# EAGLE design OE5DXL-9600 (EAGLE 7.7.0)
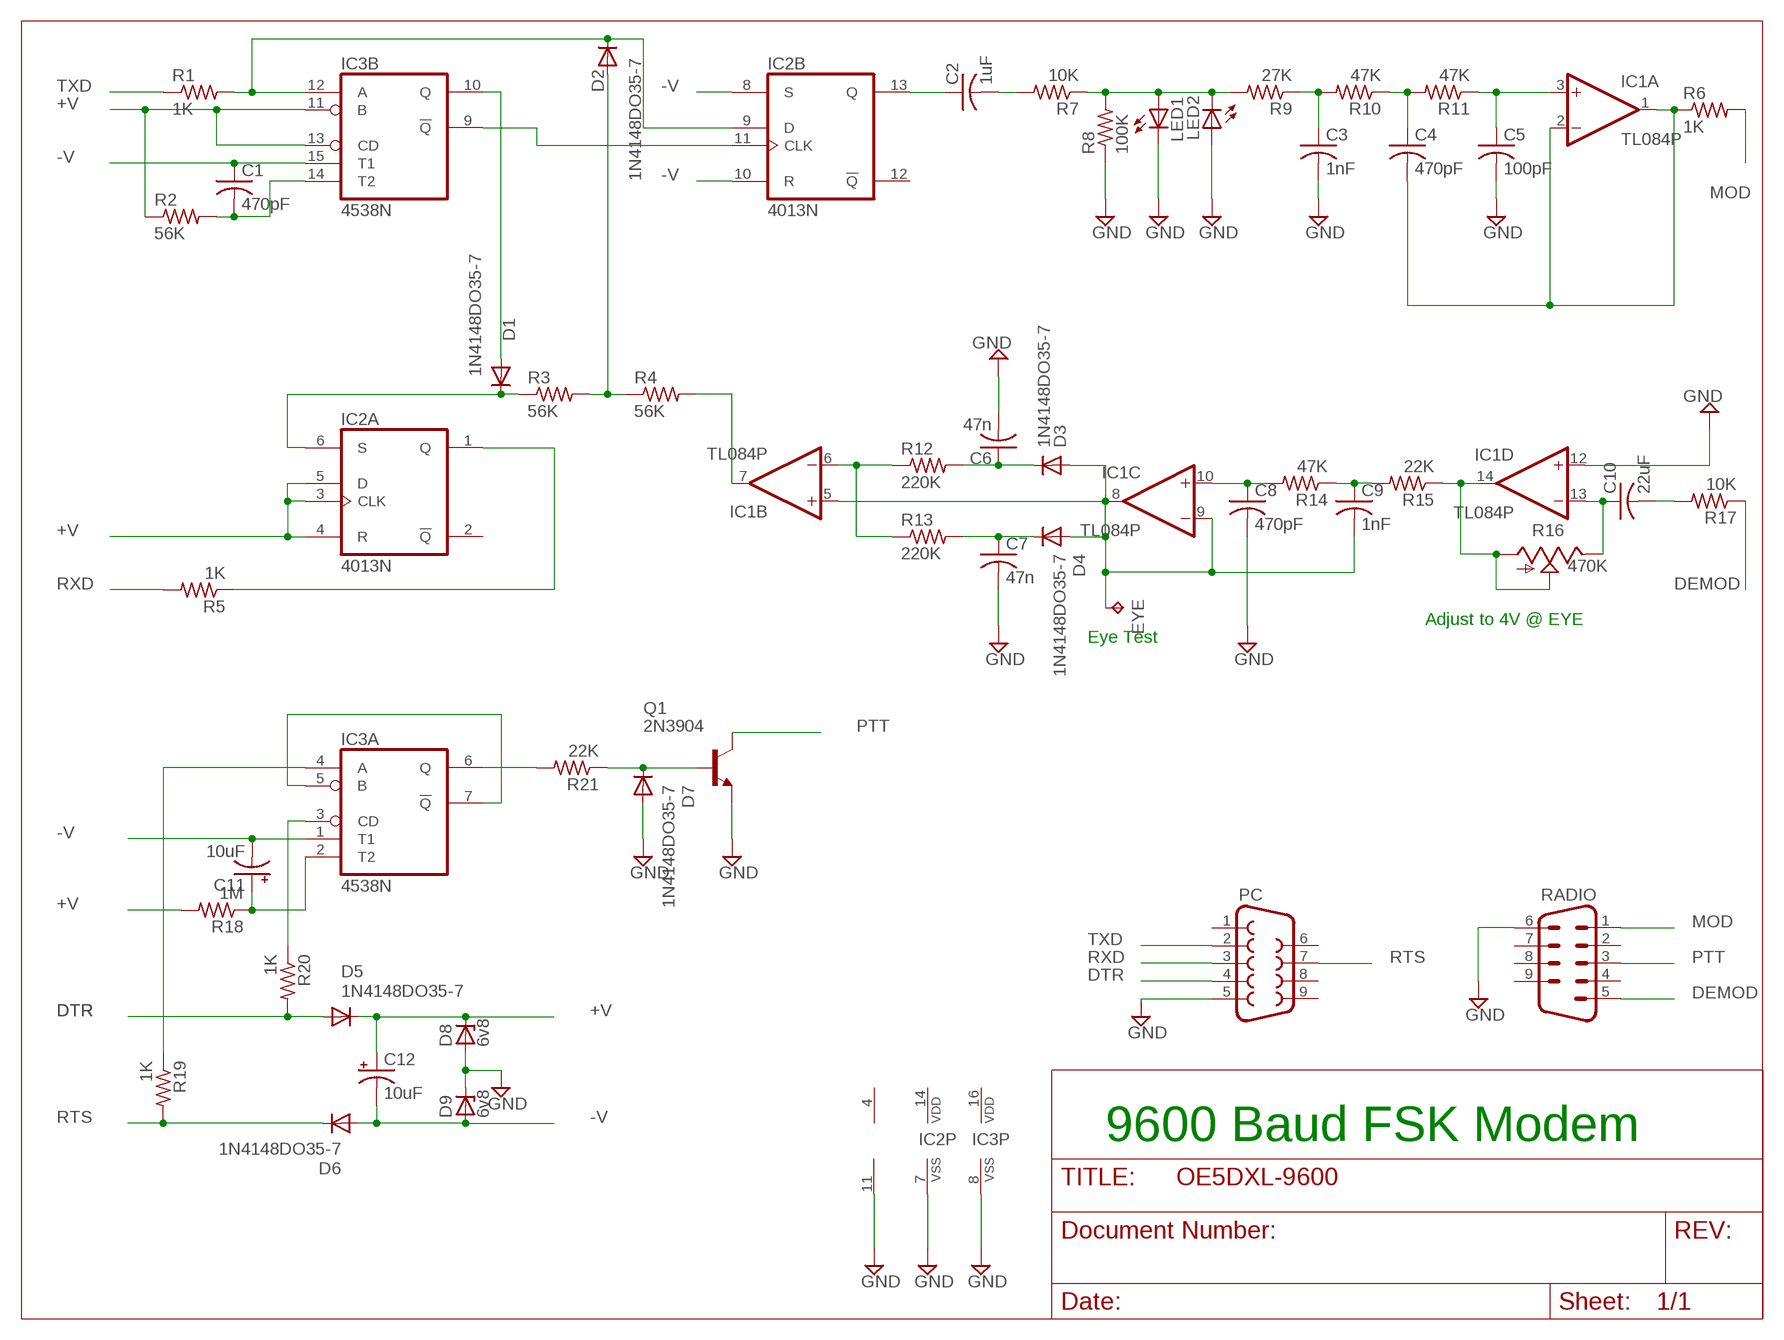
[diagram p0: schematic, sheet 1]

## Parts
C1  470pF  C-US025-025X050  [C025-025X050]
C2  1uF  C-US025-025X050  [C025-025X050]
C3  1nF  C-US025-025X050  [C025-025X050]
C4  470pF  C-US025-025X050  [C025-025X050]
C5  100pF  C-US025-025X050  [C025-025X050]
C6  47n  C-US025-025X050  [C025-025X050]
C7  47n  C-US025-025X050  [C025-025X050]
C8  470pF  C-US025-025X050  [C025-025X050]
C9  1nF  C-US025-025X050  [C025-025X050]
C10  22uF  C-US025-025X050  [C025-025X050]
C11  10uF  CPOL-USE2,5-6E  [E2,5-6E]
C12  10uF  CPOL-USE2,5-6E  [E2,5-6E]
D1  1N4148DO35-7  [DO35-7]
D2  1N4148DO35-7  [DO35-7]
D3  1N4148DO35-7  [DO35-7]
D4  1N4148DO35-7  [DO35-7]
D5  1N4148DO35-7  [DO35-7]
D6  1N4148DO35-7  [DO35-7]
D7  1N4148DO35-7  [DO35-7]
D8  6v8  ZENER-DIODEDO34-7  [DO34Z7]
D9  6v8  ZENER-DIODEDO34-7  [DO34Z7]
EYE  TPPAD1-13  [P1-13]
IC1  TL084P  [DIL14]
IC2  4013N  [DIL14]
IC3  4538N  [DIL16]
LED1  LED3MM  [LED3MM]
LED2  LED3MM  [LED3MM]
PC  F09D  [F09D]
Q1  2N3904  [TO92]
R1  1K  R-US_0207/2V  [0207/2V]
R2  56K  R-US_0207/2V  [0207/2V]
R3  56K  R-US_0207/2V  [0207/2V]
R4  56K  R-US_0207/2V  [0207/2V]
R5  1K  R-US_0207/2V  [0207/2V]
R6  1K  R-US_0207/2V  [0207/2V]
R7  10K  R-US_0207/2V  [0207/2V]
R8  100K  R-US_0207/2V  [0207/2V]
R9  27K  R-US_0207/2V  [0207/2V]
R10  47K  R-US_0207/2V  [0207/2V]
R11  47K  R-US_0207/2V  [0207/2V]
R12  220K  R-US_0207/2V  [0207/2V]
R13  220K  R-US_0207/2V  [0207/2V]
R14  47K  R-US_0207/2V  [0207/2V]
R15  22K  R-US_0207/2V  [0207/2V]
R16  470K  TRIM_US-CA6V  [CA6V]
R17  10K  R-US_0207/2V  [0207/2V]
R18  1M  R-US_0207/2V  [0207/2V]
R19  1K  R-US_0207/2V  [0207/2V]
R20  1K  R-US_0207/2V  [0207/2V]
R21  22K  R-US_0207/2V  [0207/2V]
RADIO  M09D  [M09D]

## Nets
+V: C12.+ D5.C D8.C IC2.3(A:CLK) IC2.4(A:R) IC2.5(A:D) IC3.11(B:B) IC3.13(B:CD) R2.1 R18.2
-V: C1.1 C11.- C12.- D6.A D9.A IC2.8(B:S) IC2.10(B:R) IC3.1(A:T1) IC3.15(B:T1)
DEMOD: R17.1 RADIO.5
DTR: D5.A PC.4 R20.2
GND: C3.2 C5.2 C6.2 C7.2 C8.2 D7.A D8.A D9.C IC1.11(P:V-) IC1.12(D:+IN) IC2.7(P:VSS) IC3.8(P:VSS) LED1.K(C) LED2.A PC.5 Q1.3(E) R8.1 RADIO.6
MOD: R6.2 RADIO.1
N$1: D2.C IC2.9(B:D) IC3.12(B:A) R1.2
N$2: D1.C IC2.6(A:S) R3.1
N$3: IC2.11(B:CLK) IC3.9(B:!Q)
N$4: D1.A IC3.10(B:Q)
N$5: C1.2 IC3.14(B:T2) R2.2
N$6: D2.A R3.2 R4.1
N$7: IC2.1(A:Q) R5.1
N$8: IC1.7(B:OUT) R4.2
N$9: C2.1 IC2.13(B:Q)
N$10: C2.2 R7.2
N$11: LED1.A LED2.K(C) R7.1 R8.2 R9.2
N$12: C3.1 R9.1 R10.2
N$13: C4.1 R10.1 R11.2
N$14: C5.1 IC1.3(A:+IN) R11.1
N$15: C4.2 IC1.1(A:OUT) IC1.2(A:-IN) R6.1
N$16: IC1.6(B:-IN) R12.1 R13.1
N$17: C6.1 D3.C R12.2
N$18: C9.2 D3.A D4.A EYE.TP IC1.5(B:+IN) IC1.8(C:OUT) IC1.9(C:-IN)
N$19: IC3.5(A:B) IC3.7(A:!Q)
N$20: C7.1 D4.C R13.2
N$21: C8.1 IC1.10(C:+IN) R14.2
N$22: C9.1 R14.1 R15.2
N$23: IC1.14(D:OUT) R15.1 R16.A R16.S
N$24: IC3.4(A:A) R19.1
N$25: C10.1 IC1.13(D:-IN) R16.E
N$26: C11.+ IC3.2(A:T2) R18.1
N$27: C10.2 R17.2
N$28: IC3.3(A:CD) R20.1
N$31: IC3.6(A:Q) R21.2
N$32: D7.C Q1.2(B) R21.1
PTT: Q1.1(C) RADIO.3
RTS: D6.C PC.7 R19.2
RXD: PC.3 R5.2
TXD: PC.2 R1.1
Unconnected: IC2.2(A:!Q) IC2.12(B:!Q) PC.1 PC.6 PC.8 PC.9 RADIO.2 RADIO.4 RADIO.7 RADIO.8 RADIO.9

## Notes on the sheet
- Adjust to 4V @ EYE
- Eye Test
- 9600 Baud FSK Modem

## Power pins joined to a net without a drawn wire
V+: IC1.4(P:V+)
VDD: IC2.14(P:VDD) IC3.16(P:VDD)

## Library data of the parts
C1-C10 = rcl:C-US: CAPACITOR, American symbol
C11 C12 = rcl:CPOL-US: POLARIZED CAPACITOR, American symbol
D1-D7 = diode:1N4148: DIODE high speed (Philips)
D8 D9 = diode:ZENER-DIODE: Z-Diode
EYE = testpad:TP: Test pad
IC1 = linear:TL084: OP AMP
IC2 = 40xx:4013: Dual D FLIP FLOP, set/reset
IC3 = 45xx:4538: Dual precision monostable MULTIVIBRATOR
LED1 LED2 = led:LED: LED OSRAM: - CHIPLED LG R971, LG N971, LY N971, LG Q971, LY Q971, LO R971, LY R971 LH N974, LH R974 LS Q976, LO Q976, LY Q976 LO Q996 - Hyper CHIPLED LW Q18S LB Q993, LB Q99A, LB R99A - SideLED LS A670, LO A670, LY A670, LG A670, LP A670 LB A673, LV A673, LT A673, LW A673 LH A674 LY A675 LS A676, LA A676, LO A676, LY A676, LW A676 LS A679, LY A679, LG A679 - Hyper Micro SIDELED® LS Y876, LA Y876, LO Y876, LY Y876 LT Y87S - SmartLED LW L88C, LW L88S LB L89C, LB L89S, LG L890 LS L89K, LO L89K, LY L89K LS L896, LA L896, LO L896, LY L896 - TOPLED LS T670, LO T670, LY T670, LG T670, LP T670 LSG T670, LSP T670, LSY T670, LOP T670, LYG T670 LG T671, LOG T671, LSG T671 LB T673, LV T673, LT T673, LW T673 LH T674 LS T676, LA T676, LO T676, LY T676, LB T676, LH T676, LSB T676, LW T676 LB T67C, LV T67C, LT T67C, LS T67K, LO T67K, LY T67K, LW E67C LS E67B, LA E67B, LO E67B, LY E67B, LB E67C, LV E67C, LT E67C LW T67C LS T679, LY T679, LG T679 LS T770, LO T770, LY T770, LG T770, LP T770 LB T773, LV T773, LT T773, LW T773 LH T774 LS E675, LA E675, LY E675, LS T675 LS T776, LA T776, LO T776, LY T776, LB T776 LHGB T686 LT T68C, LB T68C - Hyper Mini TOPLED® LB M676 - Mini TOPLED Santana® LG M470 LS M47K, LO M47K, LY M47K Source: http://www.osram.convergy.de LUXEON: - LUMILED® LXK2-PW12-R00, LXK2-PW12-S00, LXK2-PW14-U00, LXK2-PW14-V00 LXK2-PM12-R00, LXK2-PM12-S00, LXK2-PM14-U00 LXK2-PE12-Q00, LXK2-PE12-R00, LXK2-PE12-S00, LXK2-PE14-T00, LXK2-PE14-U00 LXK2-PB12-K00, LXK2-PB12-L00, LXK2-PB12-M00, LXK2-PB14-N00, LXK2-PB14-P00, LXK2-PB14-Q00 LXK2-PR12-L00, LXK2-PR12-M00, LXK2-PR14-Q00, LXK2-PR14-R00 LXK2-PD12-Q00, LXK2-PD12-R00, LXK2-PD12-S00 LXK2-PH12-R00, LXK2-PH12-S00 LXK2-PL12-P00, LXK2-PL12-Q00, LXK2-PL12-R00 Source: www.luxeon.com KINGBRIGHT: KA-3528ASYC Source: www.kingbright.com
PC = con-subd:F09: SUB-D; OC_FARNELL: unknown; OC_NEWARK: unknown
Q1 = transistor-npn:2N3904: NPN Transistor
R1-R15 R17-R21 = rcl:R-US_: RESISTOR, American symbol
R16 = pot:TRIM_US-: POTENTIOMETER
RADIO = con-subd:M09: SUB-D; OC_FARNELL: unknown; OC_NEWARK: unknown

## Board
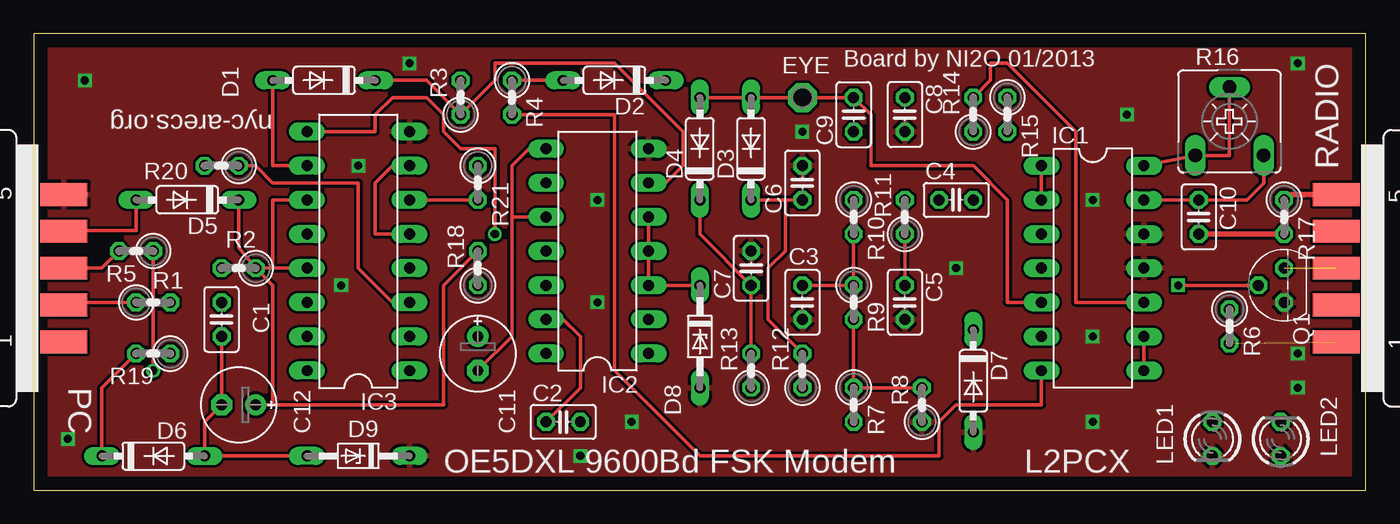
[diagram p1: board, top side]
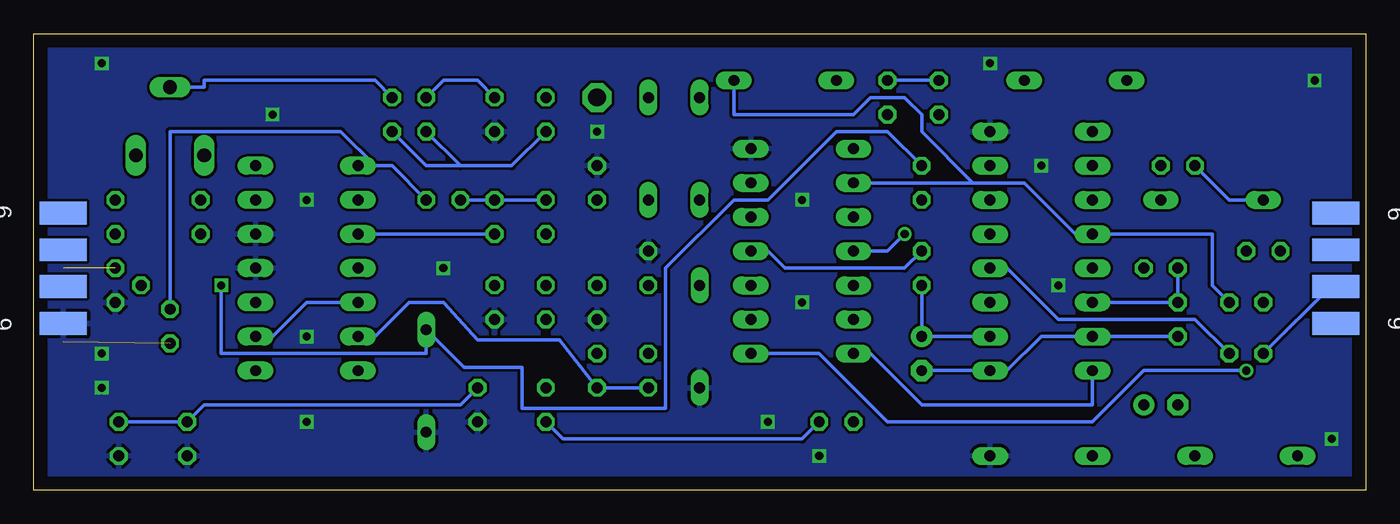
[diagram p2: board, bottom side, seen from below]

Size 99.04 x 33.96 mm. Coordinates in mm from the lower left corner, seen from the top.
Outline: 0,0 99.04,0 99.04,33.96 0,33.96 0,0
Copper layers (1*16): Top 0.035mm / dielectric 1.5mm / Bottom 0.035mm
Design rules "default": minimum track width 10mil, minimum drill 24mil, track to track 8mil, track to pad 8mil, pad to pad 8mil, via to via 8mil, smd to smd 8mil, copper to edge 40mil, drill to drill 8mil, minimum pad ring 10mil, minimum via ring 8mil, stop-mask expansion 4mil, vias tented up to drill 0mil, thermal gap 10mil

### Footprints (pad centres in the part's own frame; a part is rotated, then mirrored left to right if it is on the bottom)
C025-025X050 = drill 0.813 octagon: 1 -1.27,0; 2 1.27,0
E2,5-6E = drill 0.813 pad 1.575: + -1.27,0 | drill 0.813 pad 1.575 octagon: - 1.27,0
DO35-7 = drill 0.813 long: A 3.81,0; C -3.81,0
DO34Z7 = drill 0.813 long: A 3.81,0; C -3.81,0
P1-13 = drill 1.321 pad 2.159 octagon: TP 0,0
DIL14 = drill 0.813 long: 1 -7.62,-3.81; 2 -5.08,-3.81; 3 -2.54,-3.81; 4 0,-3.81; 5 2.54,-3.81; 6 5.08,-3.81; 7 7.62,-3.81; 8 7.62,3.81; 9 5.08,3.81; 10 2.54,3.81; 11 0,3.81; 12 -2.54,3.81; 13 -5.08,3.81; 14 -7.62,3.81
DIL16 = drill 0.813 long: 1 -8.89,-3.81; 2 -6.35,-3.81; 3 -3.81,-3.81; 4 -1.27,-3.81; 5 1.27,-3.81; 6 3.81,-3.81; 7 6.35,-3.81; 8 8.89,-3.81; 9 8.89,3.81; 10 6.35,3.81; 11 3.81,3.81; 12 1.27,3.81; 13 -1.27,3.81; 14 -3.81,3.81; 15 -6.35,3.81; 16 -8.89,3.81
LED3MM = drill 0.813 octagon: A -1.27,0; K 1.27,0
F09D = smd 1.7 x 3.5: 1 -5.486,-6.045; 2 -2.743,-6.045; 3 0,-6.045; 4 2.743,-6.045; 5 5.486,-6.045 | smd 1.7 x 3.5 bottom: 6 -4.115,-6.045; 7 -1.372,-6.045; 8 1.372,-6.045; 9 4.115,-6.045
TO92 = drill 0.813 octagon: 1 1.27,0; 2 0,1.905; 3 -1.27,0
0207/2V = drill 0.813 octagon: 1 -1.27,0; 2 1.27,0
CA6V = drill 1.016 long: A -2.54,-2.54; E 2.54,-2.54; S 0,2.54
M09D = smd 1.7 x 3.5: 1 5.486,-6.045; 2 2.743,-6.045; 3 0,-6.045; 4 -2.743,-6.045; 5 -5.486,-6.045 | smd 1.7 x 3.5 bottom: 6 4.115,-6.045; 7 1.372,-6.045; 8 -1.372,-6.045; 9 -4.115,-6.045

### Placement (x,y rotation side)
C1  13.97,12.7 90 top
C2  39.37,5.08 0 top
C3  57.15,13.97 270 top
C4  68.58,21.59 0 top
C5  64.77,13.97 270 top
C6  57.15,22.86 90 top
C7  53.34,16.51 90 top
C8  64.77,27.94 270 top
C9  60.96,27.94 90 top
C10  86.61,20.32 270 top
C11  33.02,10.16 270 top
C12  15.24,6.35 180 top
D1  21.59,30.48 180 top
D2  43.18,30.48 180 top
D3  53.34,25.4 90 top
D4  49.53,25.4 90 top
D5  11.43,21.59 180 top
D6  8.89,2.54 0 top
D7  69.85,8.13 270 top
D8  49.53,11.43 270 top
D9  24.13,2.54 180 top
EYE  57.15,29.21 0 top
IC1  78.74,16.51 270 top
IC2  41.91,17.78 90 top
IC3  24.13,17.78 90 top
LED1  87.63,3.81 270 top
LED2  92.71,3.81 90 top
PC  -3.81,16.51 90 top
Q1  92.96,15.24 90 top
R1  8.89,13.97 0 top
R2  15.24,16.51 180 top
R3  31.75,29.21 90 top
R4  35.56,29.21 270 top
R5  7.62,17.78 180 top
R6  88.9,12.19 270 top
R7  60.96,6.35 270 top
R8  66.04,6.35 90 top
R9  60.96,13.97 270 top
R10  60.96,20.32 270 top
R11  64.77,20.32 90 top
R12  57.15,8.89 90 top
R13  53.34,8.89 90 top
R14  69.85,27.94 90 top
R15  72.39,27.94 270 top
R16  88.9,27.43 0 top
R17  92.96,20.32 270 top
R18  33.02,16.51 90 top
R19  8.89,10.16 180 top
R20  13.97,24.13 180 top
R21  33.02,22.86 270 top
RADIO  102.87,16.51 270 top

### Tracks (layer width: path | path; a pad name or v marks a point on that pad's centre or on a via)
+V
  Top 0.254: R2.1 15.24,18.03 D5.C | 17.78,16.51 IC3.13 | IC3.11 17.78,21.59 17.78,16.51 | C12.+ 17.78,6.35 | 17.78,6.35 17.78,15.24 R2.1 | D8.C IC2.3 IC2.4 IC2.5 | 17.78,6.35 30.48,6.35 30.48,15.24 R18.2 | 17.78,16.51 R2.1
  Bottom 0.254: R18.2 34.29,16.51 43.18,16.51 44.45,17.78 IC2.4
-V
  Top 0.254: D9.A D6.A 12.7,5.08 C12.- C1.1 | 35.56,20.32 IC2.10 | 35.56,20.32 35.56,24.13 36.83,25.4 IC2.8 | 35.56,20.32 35.56,11.43 C11.-
  Bottom 0.254: C1.1 IC3.15 24.13,11.43 26.67,8.89 IC3.1 C11.-
DEMOD
  Top 0.406: RADIO.5 92.96,22 R17.1
DTR
  Top 0.254: D5.A 7.62,19.3 2.54,19.3 PC.4
  Bottom 0.254: D5.A 10.16,21.59 R20.2
GND  (via drill 0.6)
  other vias: 93.98,10.16 93.98,31.75 93.98,7.62 78.74,11.43 78.74,21.59 41.91,21.59 41.91,13.97 22.86,15.24 24.13,24.13 3.81,30.48 2.54,3.81 57.15,26.67 68.58,16.51 44.45,5.08 40.64,2.54 27.94,31.75 78.74,5.08 81.28,27.94
  pour Bottom: 0,0 104.14,0 104.14,34.29 0,34.29
  pour Top: 0,0 104.14,0 104.14,34.29 0,34.29
MOD  (1 unrouted)
N$1
  Bottom 0.254: R1.2 11.43,15.24 11.43,19.05 IC3.12 21.59,19.05 25.4,22.86 29.21,22.86 | 29.21,22.86 IC2.9 | D2.C 46.99,27.94 38.1,27.94 36.83,29.21 34.29,29.21 33.02,27.94 33.02,26.67 29.21,22.86
N$2
  Top 0.254: D1.C 29.21,30.48 R3.1 34.29,30.48 34.29,31.75 43.18,31.75 48.26,26.67 48.26,24.13 46.99,22.86 IC2.6
N$3  (via drill 0.61)
  Top 0.254: IC3.9 25.4,26.67 25.4,27.94 26.67,29.21 29.21,29.21 30.48,27.94 30.48,26.67 31.75,25.4 34.29,25.4 v34.29,19.05
  Bottom 0.254: v34.29,19.05 35.56,17.78 IC2.11
N$4
  Top 0.254: IC3.10 17.78,24.13 D1.A
N$5
  Bottom 0.254: IC3.14 C1.2 R2.2
N$6
  Top 0.254: R4.1 D2.A
  Bottom 0.254: R3.2 R4.1
N$7  (via drill 0.61)
  Top 0.254: v8.89,8.89 R5.1
  Bottom 0.254: v8.89,8.89 16.51,8.89 20.32,5.08 35.56,5.08 40.64,10.16 IC2.1
N$8
  Top 0.254: R4.2 43.18,27.94 43.18,8.89 49.53,2.54 67.31,2.54 67.31,5.08 68.58,6.35 74.93,6.35 IC1.7
N$9
  Top 0.254: C2.1 40.64,7.62 40.64,11.43 39.37,12.7 IC2.13
N$10
  Bottom 0.254: C2.2 41.91,3.81 59.69,3.81 R7.2
N$11
  Top 0.254: R9.2 R7.1 R8.2
  Bottom 0.254: LED2.K LED1.A 86.36,6.35 67.31,6.35 R8.2
N$12
  Top 0.254: R10.2 R9.1 C3.1
N$13
  Bottom 0.254: R10.1 R11.2 C4.1
N$14
  Top 0.254: C5.1 R11.1
  Bottom 0.254: R11.1 IC1.3
N$15
  Top 0.254: IC1.1 IC1.2
  Bottom 0.254: C4.2 72.39,24.13 73.66,24.13 | R6.1 88.9,26.67 76.2,26.67 73.66,24.13 | 73.66,24.13 IC1.1
N$16
  Bottom 0.254: R13.1 R12.1 59.94,11.18 66.04,11.18 68.58,13.97 71.12,13.97 73.66,11.43 IC1.6
N$17
  Top 0.254: 55.88,21.59 C6.1 | 55.88,21.59 D3.C | R12.2 54.61,12.7 54.61,16.51 55.88,17.78 55.88,21.59
N$18
  Top 0.254: IC1.9 IC1.8 | D4.A D3.A EYE.TP C9.2 62.23,27.94 62.23,24.13 69.85,24.13 72.39,21.59 72.39,13.97 IC1.5
  Bottom 0.254: IC1.5 78.74,13.97 81.28,11.43 IC1.9
N$19
  Top 0.254: IC3.5 25.4,19.05 25.4,22.86 26.67,24.13 IC3.7
N$20
  Top 0.254: R13.2 C7.1 49.53,19.05 D4.C
N$21
  Top 0.254: IC1.10 77.47,13.97 77.47,26.67 72.39,31.75 71.12,31.75 71.12,30.48 R14.2
  Bottom 0.254: C8.1 66.04,30.48 68.58,30.48 R14.2
N$22
  Bottom 0.254: C9.1 63.5,24.13 67.31,24.13 | 67.31,24.13 R14.1 | R15.2 69.85,24.13 67.31,24.13
N$23
  Top 0.254: IC1.14 R16.A 88.9,24.89 R16.S
  Bottom 0.254: R15.1 73.66,30.48 86.36,30.48 86.36,29.97 R16.S
N$24
  Bottom 0.254: R19.1 12.7,12.7 22.86,12.7 26.67,16.51 IC3.4
N$25
  Top 0.254: IC1.13 C10.1 90.17,21.59 91.44,22.86 R16.E
N$26
  Bottom 0.254: R18.1 C11.+ IC3.2
N$27
  Top 0.406: C10.2 R17.2
N$28
  Top 0.254: R20.1 16.51,24.13 17.78,22.86 24.13,22.86 24.13,16.51 26.67,13.97 IC3.3
N$31
  Top 0.254: IC3.6 R21.2
N$32  (via drill 0.6)
  Top 0.254: v85.09,15.24 Q1.2
  Bottom 0.254: v85.09,15.24 85.09,10.16 69.85,10.16 D7.C 67.06,9.14 62.74,9.14 62.74,6.1 52.07,6.1 52.07,16.51 46.99,21.59 44.45,21.59 39.37,26.67 35.56,26.67 R21.1
PTT  (1 unrouted)
RTS
  Top 0.254: D6.C 5.08,7.62 R19.2
  Bottom 0.254: R19.2 2.54,15.24 PC.7
RXD
  Top 0.254: R5.2 5.08,16.51 PC.3
TXD
  Top 0.254: R1.1 2.54,13.97 PC.2
VDD
  Bottom 0.254: IC3.16 20.32,6.35 33.02,6.35 36.83,10.16 IC2.14

### Text on the board
tNames: Board by NI2O 01/2013 | nyc-arecs.org | OE5DXL 9600Bd FSK Modem | L2PCX